# Altium schematic sheet Sheet2.SchDoc
size B
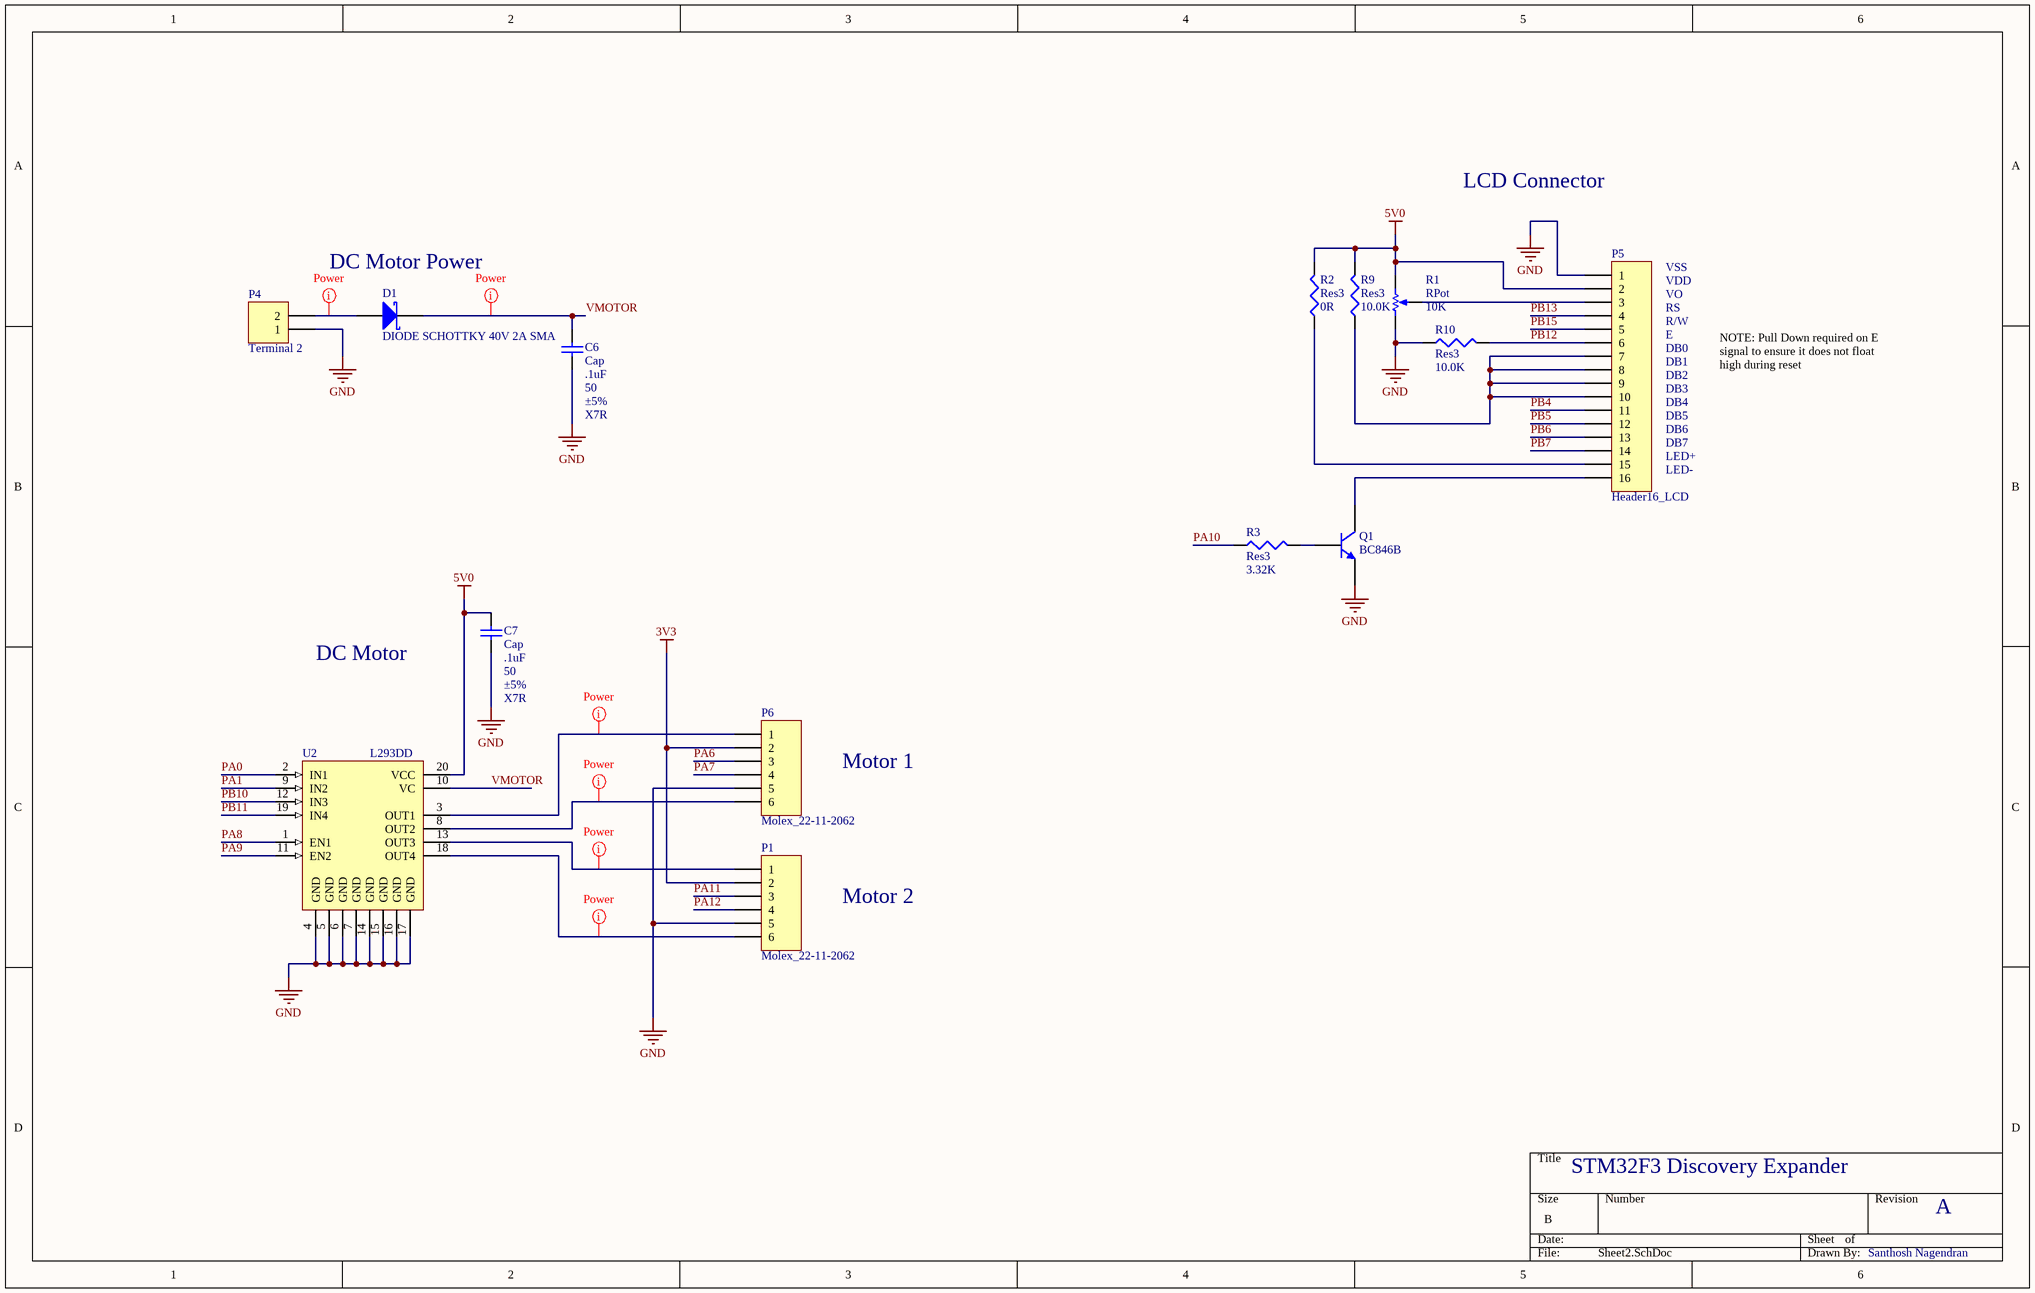
[diagram p0: Sheet2.SchDoc]

## Parts
C6  Cap  value .1uF  WV: 50  Tolerance: ±5%  Type: X7R  [CAPC2012X09M]
C7  Cap  value .1uF  WV: 50  Tolerance: ±5%  Type: X7R  [CAPC2012X09M]
D1  DIODE SCHOTTKY 40V 2A SMA  [DIOM4326X23M]
P1  Molex_22-11-2062  [MOLEX_22-11-2062]
P4  Terminal 2  [TYCO_282841_2]
P5  Header16_LCD  [HDR1X16_LCD]
P6  Molex_22-11-2062  [MOLEX_22-11-2062]
Q1  BC846B  [SOT95P230X110-3M]
R1  RPot  value 10K  [BOURNS_3386F]
R2  Res3  value 0R  [RESC2112X05M]
R3  Res3  value 3.32K  [RESC2112X05M]
R9  Res3  value 10.0K  [RESC2112X05M]
R10  Res3  value 10.0K  [RESC2112X05M]
U2  L293DD  [SO20_N]

## Nets
3V3: P1.2 P6.2
5V0: C7.2 P5.2 R1.3(BOT) R2.2 R9.2 U2.20(VCC)
GND: C6.1 C7.1 P1.5 P4.1 P5.1 P6.5 Q1.2(E) R1.1(TOP) R10.1 U2.4(GND) U2.5(GND) U2.6(GND) U2.7(GND) U2.14(GND) U2.15(GND) U2.16(GND) U2.17(GND)
PA0: U2.2(IN1)
PA1: U2.9(IN2)
PA6: P6.3
PA7: P6.4
PA8: U2.1(EN1)
PA9: U2.11(EN2)
PA10: R3.1
PA11: P1.3
PA12: P1.4
PB4: P5.11
PB5: P5.12
PB6: P5.13
PB7: P5.14
PB10: U2.12(IN3)
PB11: U2.19(IN4)
PB12: P5.6 R10.2
PB13: P5.4
PB15: P5.5
VMOTOR: C6.2 D1.1(K) U2.10(VC)
NetD1_2: D1.2(A) P4.2
NetP1_1: P1.1 U2.13(OUT3)
NetP1_6: P1.6 U2.18(OUT4)
NetP5_3: P5.3 R1.2(TAP)
NetP5_7: P5.7 P5.8 P5.9 P5.10 R9.1
NetP5_15: P5.15 R2.1
NetP5_16: P5.16 Q1.3(C)
NetP6_1: P6.1 U2.3(OUT1)
NetP6_6: P6.6 U2.8(OUT2)
NetQ1_1: Q1.1(B) R3.2

## Layout directives
net class Power: NetD1_2, NetP1_1, NetP1_6, NetP6_1, NetP6_6, VMOTOR

## Notes on the sheet
- LCD Connector
- DC Motor Power
- VSS
- VDD
- VO
- RS
- R/W
- E
- DB0
- DB1
- NOTE: Pull Down required on E signal to ensure it does not float high during reset
- DB2
- DB3
- DB4
- DB5
- DB6
- DB7
- LED+
- LED-
- DC Motor
- Motor 1
- Motor 2
- STM32F3 Discovery Expander
- A
- Santhosh Nagendran

## Library data of the parts
C6 C7 = CAP-X7R-.1uF-50V-±5%: CAP CER .1uF 50v X7R 0805; MPN: C0805C104J5RACTU; PN: 399-1171-1-ND; Name: CAP-X7R-.1uF-50V-±5%; URL: http://www.digikey.ca/product-detail/en/C0805C104J5RACTU/399-1171-1-ND
D1 = DIODE SCHOTTKY 40V 2A SMA: Schottky Rectifier; MPN: B240A-13-F; PN: B240A-FDICT-ND; URL: http://www.digikey.ca/product-detail/en/B240A-13-F/B240A-FDICT-ND
P1 P6 = Molex_22-11-2062: CONN HEADER 6POS .100 VERT GOLD; MPN: 0022112062; PN: WM2704-ND; URL: http://www.digikey.ca/product-detail/en/0022112062/WM2704-ND
P4 = Terminal 2: Terminal, 2-Pin; MPN: 282841-2; PN: A98342-ND; LatestRevisionDate: 17-Jul-2002; LatestRevisionNote: Re-released for DXP Platform.; Publisher: Altium Limited; URL: http://www.digikey.ca/product-detail/en/282841-2/A98342-ND/1136740
P5 = Header16_LCD: Header, 16-Pin Female; MPN: PPPC161LFBN-RC; PN: S7049-ND; URL: http://www.digikey.ca/product-detail/en/PPPC161LFBN-RC/S7049-ND
Q1 = BC846B: TRANS NPN 65V 0.1A SOT23; MPN: BC846BLT3G; PN: BC846BLT3GOSCT-ND; URL: https://www.digikey.ca/product-detail/en/on-semiconductor/BC846BLT3G/BC846BLT3GOSCT-ND
R1 = RPot: POT 10K OHM THUMBWHEEL CERM ST; MPN: 3352T-1-103LF; Sim Note: Enter the Resistance value and the set point into parameter fields.; Set Position: 0.5; PN: 3352T-103LF-ND; Published: 8-Jun-2000; LatestRevisionDate: 17-Jul-2002; LatestRevisionNote: Re-released for DXP Platform.; PackageReference: VR5; Publisher: Altium Limited; PackageDescription: Variable Resistor, Thru-Hole; 3 Leads; URL: http://www.digikey.ca/product-detail/en/3352T-1-103LF/3352T-103LF-ND
R2 = Resistor_0R_Jumper: RES SMD 0 OHM 5% 1/8W 0805; MPN: CRCW08050000Z0EA; PN: 541-0.0ACT-ND; Name: Resistor_0R_Jumper; URL: http://www.digikey.ca/product-detail/en/CRCW08050000Z0EA/541-0.0ACT-ND
R3 = Resistor_3.32K: RES SMD 3.32K OHM 1% 1/8W 0805; MPN: CRCW08053K32FKEA; PN: 541-3.32KCCT-ND; Name: Resistor_3.32K; URL: http://www.digikey.ca/product-detail/en/CRCW08053K32FKEA/541-3.32KCCT-ND
R9 R10 = Resistor_10.0K: RES SMD 10.0K OHM 1% 1/8W 0805; MPN: CRCW080510K0FKEA; PN: 541-10.0KCCT-ND; Name: Resistor_10.0K; URL: http://www.digikey.ca/product-detail/en/CRCW080510K0FKEA/541-10.0KCCT-ND
U2 = L293DD: IC MOTOR DRIVER PAR 20-SOIC; MPN: L293DD013TR; PN: 497-2937-1-ND; Published: 8-Jun-2000; LatestRevisionDate: 13-Apr-2006; LatestRevisionNote: IPC-7351 Footprint Added.; DatasheetVersion: Jun-1996; PackageVersion: Jul-2001; PackageReference: SO20; Publisher: Altium Limited; PackageDescription: 20-Pin Plastic Small Outline Integrated Circuit 1.27 mm Pitch; Code_JEDEC: MS-013-AC; Code_IPC: SOIC127P1030-20; ComponentLink1Description: Manufacturer Link; ComponentLink1URL: http://www.st.com/; ComponentLink2Description: Datasheet; ComponentLink2URL: http://www.st.com/stonline/products/literature/ds/1330/l293d.pdf; URL: http://www.digikey.ca/product-detail/en/L293DD013TR/497-2937-1-ND